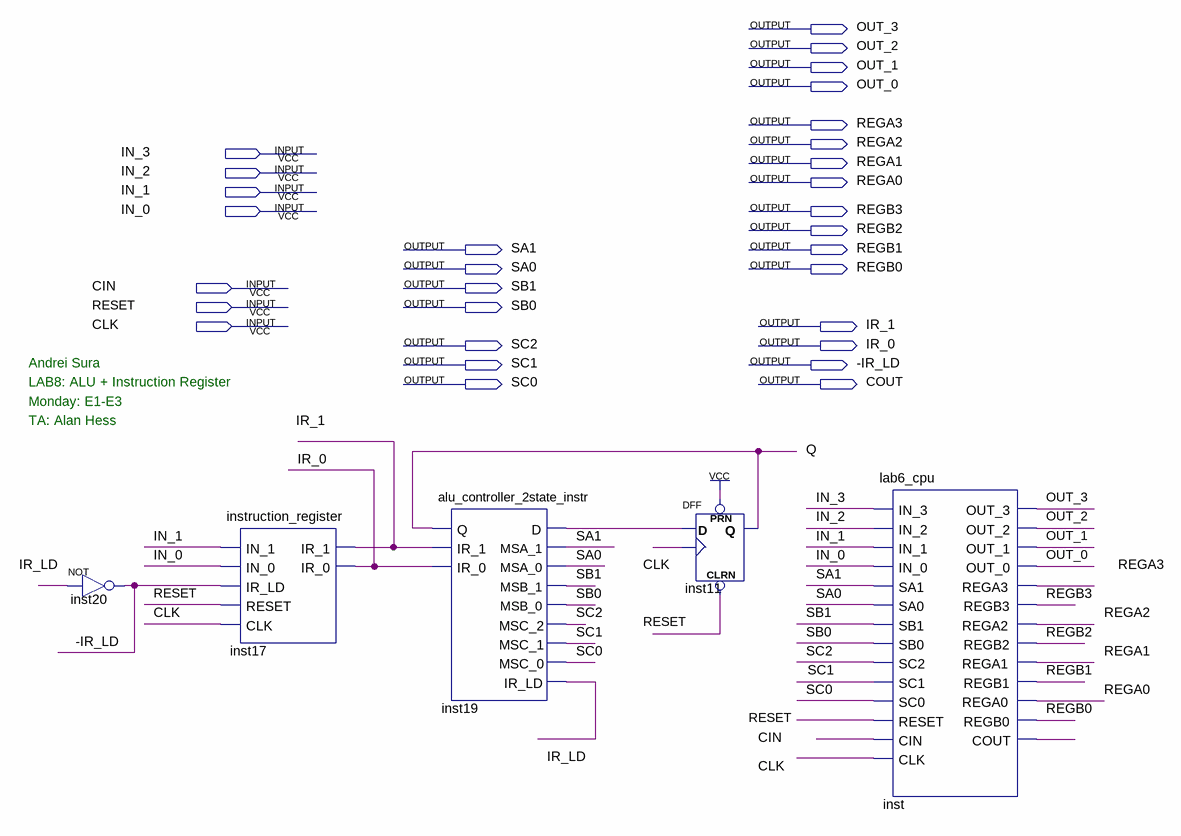
[diagram p0: schematic sheet]
// Quartus schematic alu_ir.bdf as structural Verilog: 5 symbols, 30 pins
module alu_ir (
  input  IN_3,
  input  IN_2,
  input  IN_1,
  input  IN_0,
  input  CIN,
  input  RESET,
  input  CLK,
  output OUT_3,
  output OUT_2,
  output OUT_1,
  output OUT_0,
  output REGA3,
  output REGA2,
  output REGA1,
  output REGA0,
  output REGB3,
  output REGB2,
  output SA1,
  output REGB1,
  output SA0,
  output REGB0,
  output SB1,
  output SB0,
  output IR_1,
  output SC2,
  output IR_0,
  output SC1,
  output \-IR_LD ,
  output SC0,
  output COUT
);

  wire inst19_d, inst_cout, IR_LD, Q;

  not inst20 (\-IR_LD , IR_LD);
  instruction_register inst17 (
    .IN_1(IN_1), .IN_0(IN_0), .IR_LD(\-IR_LD ), .RESET(RESET), .CLK(CLK), .IR_1(IR_1), .IR_0(IR_0));
  alu_controller_2state_instr inst19 (
    .Q(Q), .IR_1(IR_1), .IR_0(IR_0), .D(inst19_d), .MSA_1(SA1), .MSA_0(SA0), .MSB_1(SB1), .MSB_0(SB0),
    .MSC_2(SC2), .MSC_1(SC1), .MSC_0(SC0), .IR_LD(IR_LD));
  DFF inst11 (.CLRN(RESET), .CLK(CLK), .D(inst19_d), .PRN(1'b1), .Q(Q));
  lab6_cpu inst (
    .IN_3(IN_3), .IN_2(IN_2), .IN_1(IN_1), .IN_0(IN_0), .SA1(SA1), .SA0(SA0), .SB1(SB1), .SB0(SB0),
    .SC2(SC2), .SC1(SC1), .SC0(SC0), .RESET(RESET), .CIN(CIN), .CLK(CLK), .OUT_3(OUT_3), .OUT_2(OUT_2),
    .OUT_1(OUT_1), .OUT_0(OUT_0), .REGA3(REGA3), .REGB3(REGB3), .REGA2(REGA2), .REGB2(REGB2), .REGA1(REGA1),
    .REGB1(REGB1), .REGA0(REGA0), .REGB0(REGB0), .COUT(inst_cout));

  // Notes on the sheet:
  //   Andrei Sura
  //   LAB8: ALU + Instruction Register
  //   Monday: E1-E3
  //   TA: Alan Hess
endmodule
